# Altium schematic sheet Buck.SchDoc
size 190 x 177 mm; Author: iliya asghari; SheetNumber: 1; SheetTotal: 1
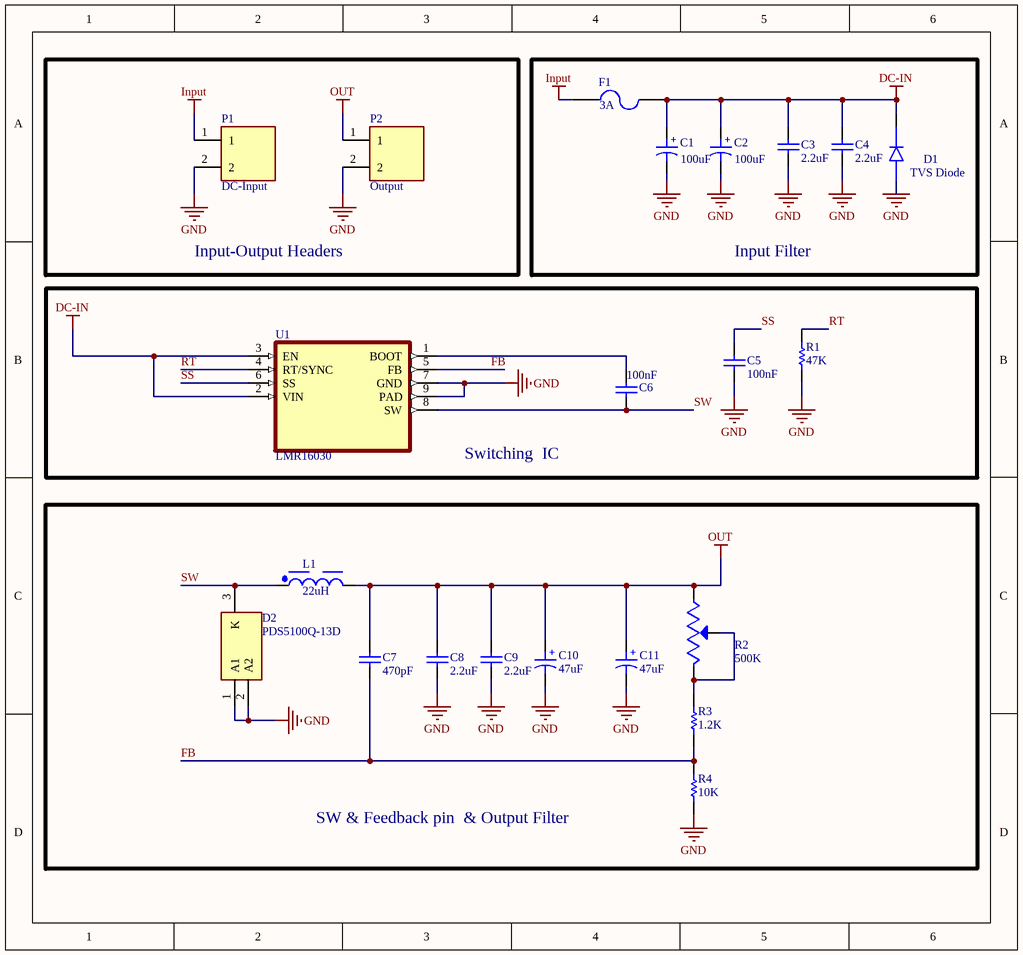
[diagram p0: Buck.SchDoc]

## Parts
C1  100uF  [CAPACITOR-10mm]
C2  100uF  [CAPACITOR-10mm]
C3  2.2uF  [CAPACITOR-0805]
C4  2.2uF  [CAPACITOR-0805]
C5  100nF  [CAPACITOR-0805]
C6  100nF  [CAPACITOR-0805]
C7  470pF  [CAPACITOR-0603]
C8  2.2uF  [CAPACITOR-0805]
C9  2.2uF  [CAPACITOR-0805]
C10  47uF  [CAPACITOR-10mm]
C11  47uF  [CAPACITOR-10mm]
D1  TVS Diode  [SMB DIODE]
D2  PDS5100Q-13D  [PDS5100Q13D]
F1  3A  [FUSE-1206]
L1  22uH  [Power Inductor]
P1  DC-Input  [2 Pin Terminal Block 5mm Pitch]
P2  Output  [2 Pin Terminal Block 5mm Pitch]
R1  47K  [Resistor-0805]
R2  500K  [Multi turn]
R3  1.2K  [Resistor-0805]
R4  10K  [Resistor-0805]
U1  LMR16030  [LMR16030]

## Blocks framed on the sheet
Input-Output Headers: P1 P2
Input Filter: C1-C4 D1 F1
Switching  IC: C5 C6 R1 U1
SW & Feedback pin  & Output Filter: C7-C11 D2 L1 R2-R4

## Nets
DC-IN: C1.1 C2.1 C3.2 C4.2 D1.C F1.2 U1.2(VIN) U1.3(EN)
GND: C1.2 C2.2 C3.1 C4.1 C5.2 C8.1 C9.1 C10.2 C11.2 D1.A D2.1(A1) D2.2(A2) P1.2 P2.2 R1.1 R4.1 U1.7(GND) U1.9(PAD)
Input: F1.1 P1.1
OUT: C7.2 C8.2 C9.2 C10.1 C11.1 L1.2 P2.1 R2.1(CCW)
FB: C7.1 R3.1 R4.2 U1.5(FB)
RT: R1.2 U1.4(RT/SYNC)
SS: C5.1 U1.6(SS)
SW: C6.2 D2.3(K) L1.1 U1.8(SW)
NetC6_1: C6.1 U1.1(BOOT)
NetR2_2: R2.2(WIPER) R2.3(CW) R3.2

## Notes on the sheet
- (in symbol Capacitor Electrolytic) +

## Library data of the parts
C1 C2 = Capacitor Electrolytic: 100uF-63V
C3 C4 C8 C9 = Capacitor: 2.2uF-100V-0805-X7R
C5 C6 = Capacitor: 100nF-100V-0805-X7R
C7 = Capacitor: 470pF-100V-0603-C0G
C10 C11 = Capacitor Electrolytic: 47uF-80V
D1 = Diode: SMB-J51A
D2 = Schottky Diode
F1 = Fuse: PTC Fuse- 3A- 1206
L1 = Power Inductor: 22uH-TMPC1265HP-220MG-D
P1 P2 = Header 2 pin: KF301-5.0-2pin
R1 = Resistor: Resisto47K-0805
R2 = Multi Turn: 500K multi turn
R3 = Resistor: Resistor 100K-0805
R4 = Resistor: Resistor 10K-0805
U1 = LMR16030: LMR16030-Switching Regulator